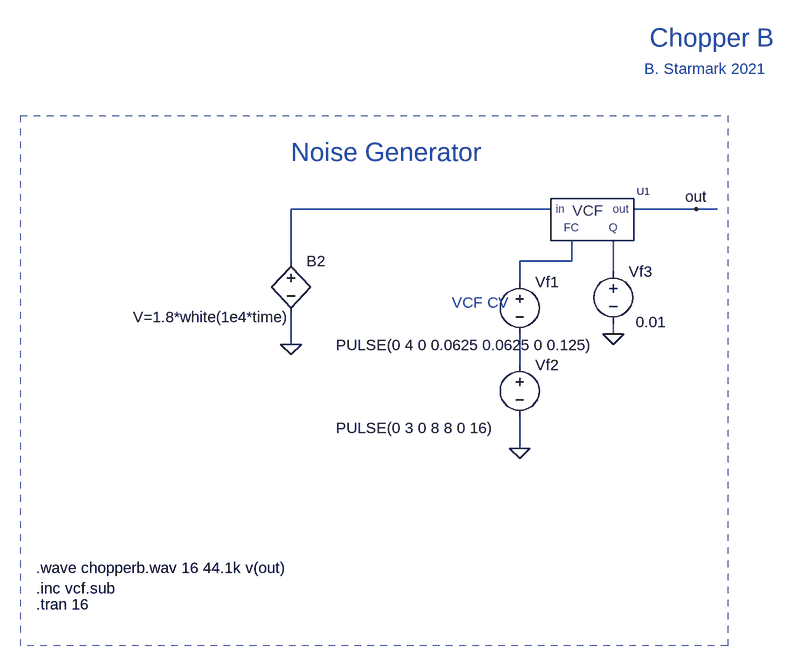
[diagram p0: schematic chopperb.asc]
chopperb.asc, the LTspice schematic file:
Version 4
SHEET 1 1536 2476
WIRE -1088 0 -1488 0
WIRE -864 0 -960 0
WIRE -832 0 -864 0
WIRE -1488 80 -1488 0
WIRE -1056 80 -1056 48
WIRE -1056 80 -1136 80
WIRE -992 96 -992 48
WIRE -1136 112 -1136 80
WIRE -992 192 -992 176
WIRE -1488 208 -1488 160
WIRE -1136 240 -1136 192
WIRE -1136 368 -1136 320
FLAG -1488 208 0
FLAG -864 0 out
FLAG -1136 368 0
FLAG -992 192 0
SYMBOL voltage -1136 96 R0
WINDOW 123 0 0 Left 0
WINDOW 39 0 0 Left 0
WINDOW 3 -283 113 Left 2
SYMATTR Value PULSE(0 4 0 0.0625 0.0625 0 0.125)
SYMATTR InstName Vf1
SYMBOL bv -1488 64 R0
WINDOW 3 -243 102 Left 2
SYMATTR Value V=1.8*white(1e4*time)
SYMATTR InstName B2
SYMBOL voltage -1136 224 R0
WINDOW 123 0 0 Left 0
WINDOW 39 0 0 Left 0
WINDOW 3 -283 113 Left 2
SYMATTR Value PULSE(0 3 0 8 8 0 16)
SYMATTR InstName Vf2
SYMBOL vcf -1024 -32 R0
SYMATTR InstName U1
SYMBOL voltage -992 80 R0
WINDOW 123 0 0 Left 0
WINDOW 39 0 0 Left 0
WINDOW 3 35 94 Left 2
SYMATTR Value 0.01
SYMATTR InstName Vf3
TEXT -936 -264 Left 4 ;Chopper B
TEXT -1488 -88 Left 4 ;Noise Generator
TEXT -1240 144 Left 2 ;VCF CV
TEXT -944 -216 Left 2 ;B. Starmark 2021
TEXT -1880 608 Left 2 !.tran 16
TEXT -1880 584 Left 2 !.inc vcf.sub
TEXT -1880 552 Left 2 !.wave chopperb.wav 16 44.1k v(out)
RECTANGLE Normal -816 672 -1904 -144 2

The netlist it stands for:
* chopperb.asc
Vf1 N002 N004 PULSE(0 4 0 0.0625 0.0625 0 0.125)
B2 N001 0 V=1.8*white(1e4*time)
Vf2 N004 0 PULSE(0 3 0 8 8 0 16)
XU1 N001 out N002 N003 vcf  ; pins in out FC Q
Vf3 N003 0 0.01
* Chopper B
* Noise Generator
* VCF CV
* B. Starmark 2021
.tran 16
.inc vcf.sub
.wave chopperb.wav 16 44.1k v(out)
.backanno
.end